# EAGLE design Kb_right (EAGLE 9.6.2)
COMPANY: ADAFRUIT INDUSTRIES; DRAWN: KTOWN; REV: B
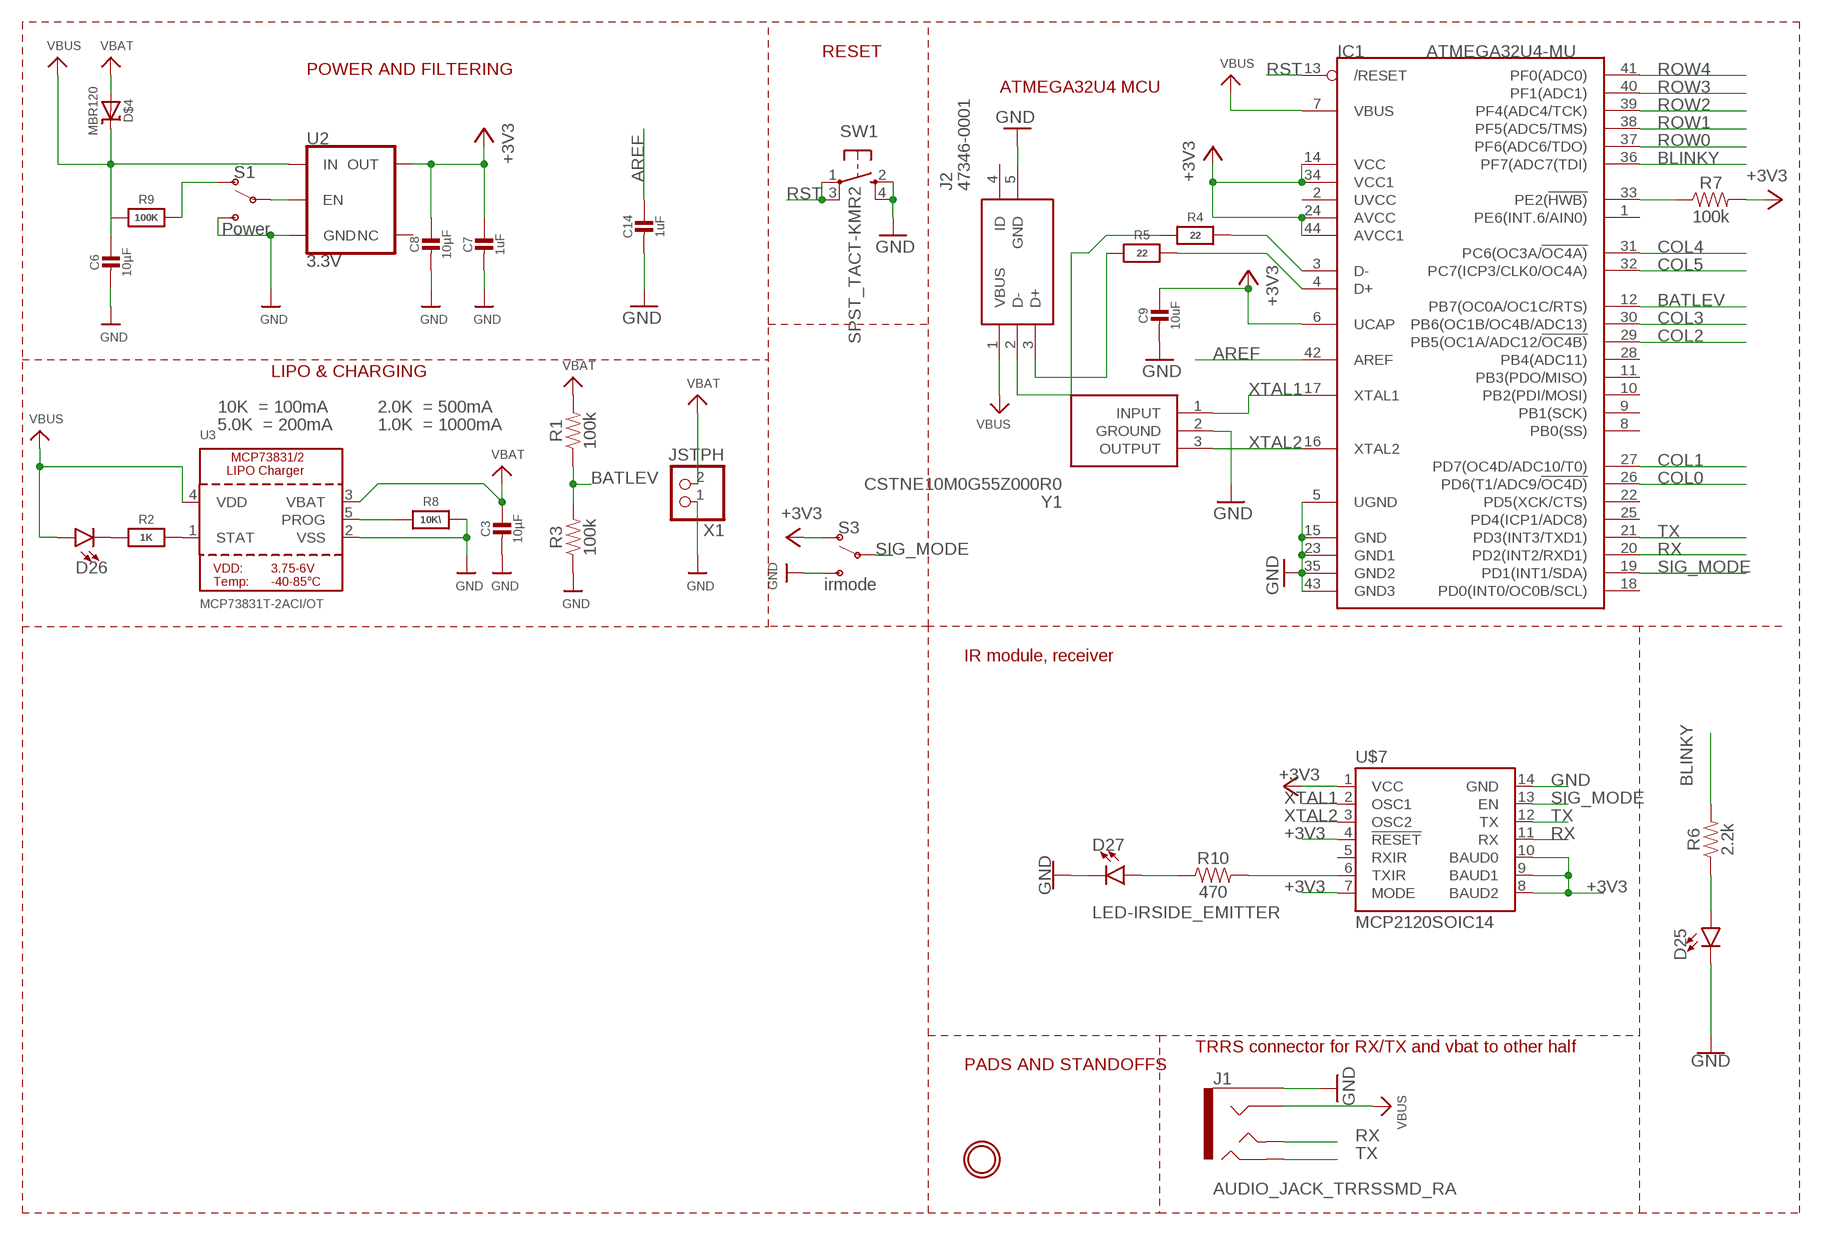
[diagram p0: schematic, sheet 1, part 1 of 2]
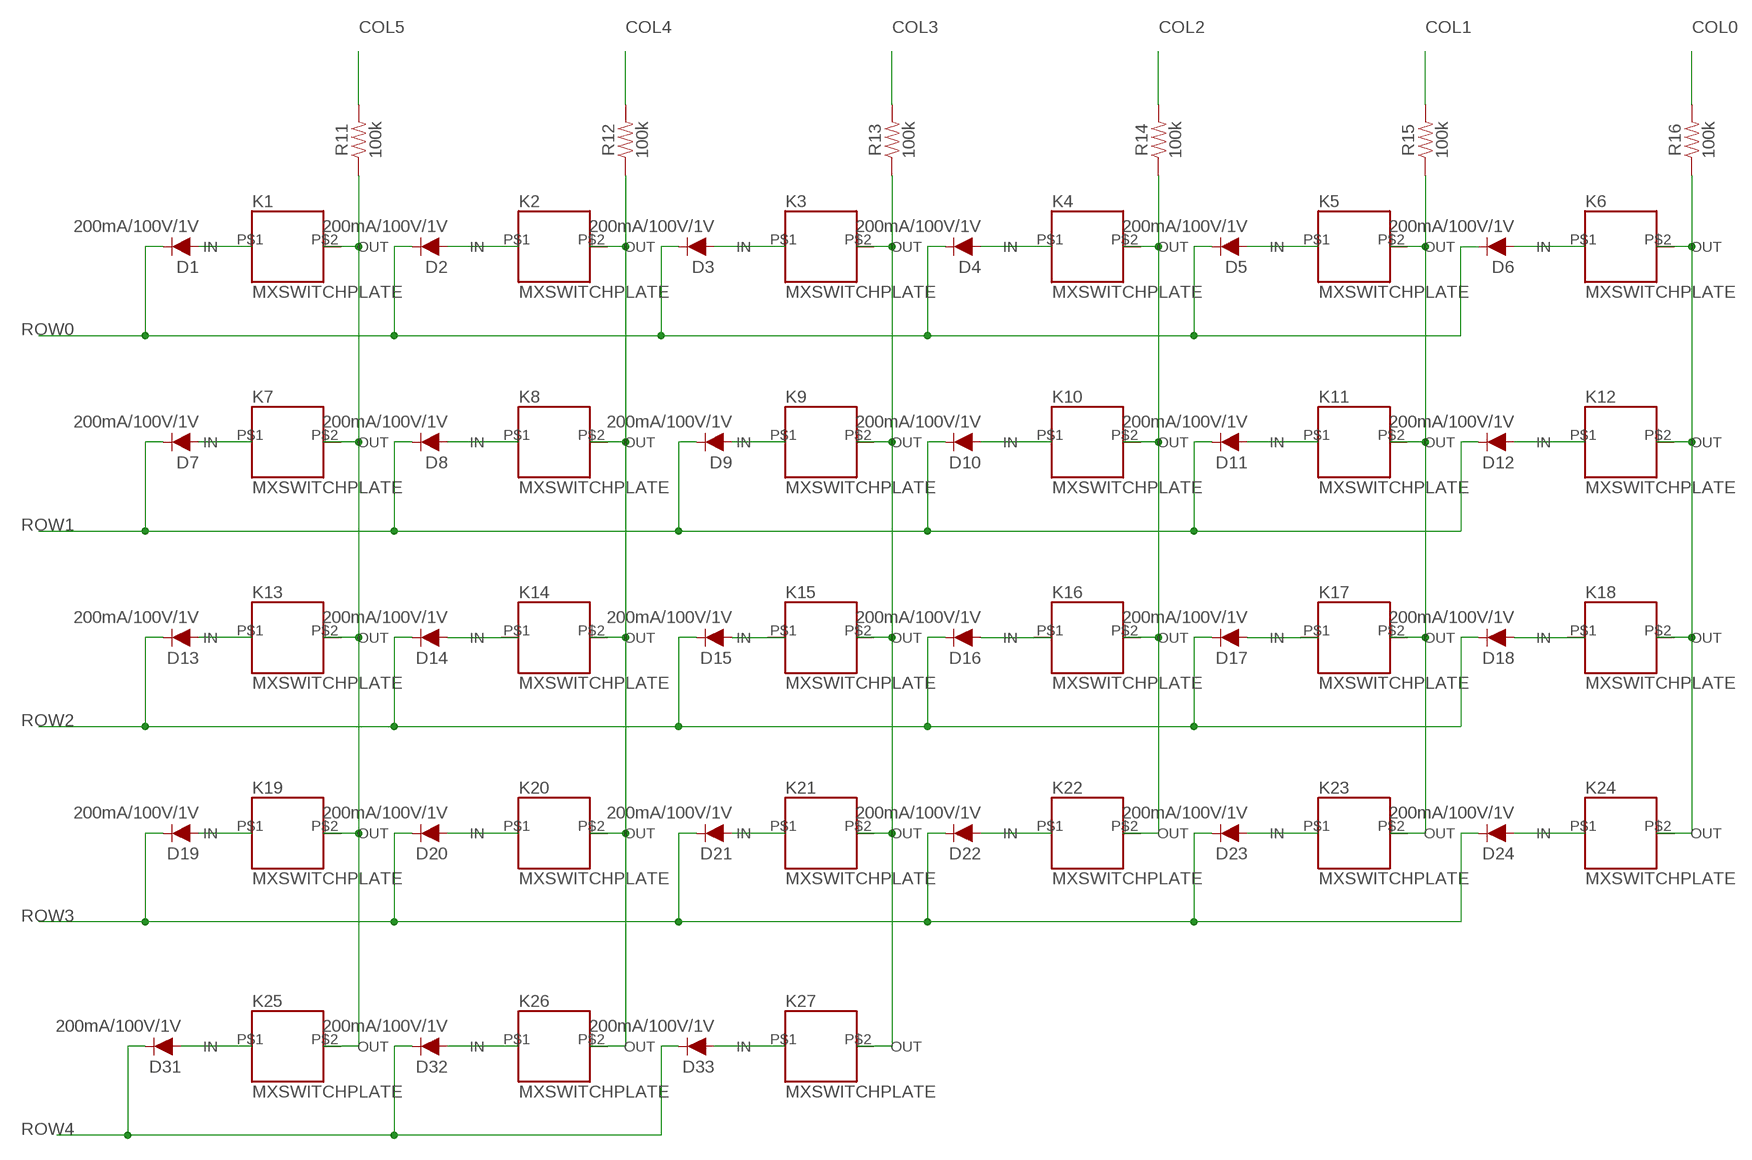
[diagram p1: schematic, sheet 1, part 2 of 2]

## Parts
C3  10µF  CAP_CERAMIC0805-NOOUTLINE  [0805-NO]
C6  10µF  CAP_CERAMIC0805-NOOUTLINE  [0805-NO]
C7  1uF  CAP_CERAMIC0603_NO  [0603-NO]
C8  10µF  CAP_CERAMIC0805-NOOUTLINE  [0805-NO]
C9  10uF  CAP_CERAMIC_0805MP  [_0805MP]
C14  1uF  CAP_CERAMIC0603_NO  [0603-NO]
D1  200mA/100V/1V  DIODE-1N4148  [DIODE-1N4148]
D2  200mA/100V/1V  DIODE-1N4148  [DIODE-1N4148]
D3  200mA/100V/1V  DIODE-1N4148  [DIODE-1N4148]
D4  200mA/100V/1V  DIODE-1N4148  [DIODE-1N4148]
D5  200mA/100V/1V  DIODE-1N4148  [DIODE-1N4148]
D6  200mA/100V/1V  DIODE-1N4148  [DIODE-1N4148]
D7  200mA/100V/1V  DIODE-1N4148  [DIODE-1N4148]
D8  200mA/100V/1V  DIODE-1N4148  [DIODE-1N4148]
D9  200mA/100V/1V  DIODE-1N4148  [DIODE-1N4148]
D10  200mA/100V/1V  DIODE-1N4148  [DIODE-1N4148]
D11  200mA/100V/1V  DIODE-1N4148  [DIODE-1N4148]
D12  200mA/100V/1V  DIODE-1N4148  [DIODE-1N4148]
D13  200mA/100V/1V  DIODE-1N4148  [DIODE-1N4148]
D14  200mA/100V/1V  DIODE-1N4148  [DIODE-1N4148]
D15  200mA/100V/1V  DIODE-1N4148  [DIODE-1N4148]
D16  200mA/100V/1V  DIODE-1N4148  [DIODE-1N4148]
D17  200mA/100V/1V  DIODE-1N4148  [DIODE-1N4148]
D18  200mA/100V/1V  DIODE-1N4148  [DIODE-1N4148]
D19  200mA/100V/1V  DIODE-1N4148  [DIODE-1N4148]
D20  200mA/100V/1V  DIODE-1N4148  [DIODE-1N4148]
D21  200mA/100V/1V  DIODE-1N4148  [DIODE-1N4148]
D22  200mA/100V/1V  DIODE-1N4148  [DIODE-1N4148]
D23  200mA/100V/1V  DIODE-1N4148  [DIODE-1N4148]
D24  200mA/100V/1V  DIODE-1N4148  [DIODE-1N4148]
D25  LED-3MM-NO_SILK  [LED_3MM-NS]
D26  LED-3MM-NO_SILK  [LED_3MM-NS]
D27  LED-IRSIDE_EMITTER  [LTE-302]
D31  200mA/100V/1V  DIODE-1N4148  [DIODE-1N4148]
D32  200mA/100V/1V  DIODE-1N4148  [DIODE-1N4148]
D33  200mA/100V/1V  DIODE-1N4148  [DIODE-1N4148]
D$4  MBR120  DIODE-SCHOTTKYSOD-123  [SOD-123]
IC1  ATMEGA32U4-MU  [TQFN44_7MM]
J1  AUDIO_JACK_TRRSSMD_RA  [AUDIO_JACK_3.5MM_TRRS_SMD_RA]
J2  47346-0001  [47346-0001]
K1  MXSWITCHPLATE  [MXSWITCHPLATE]
K2  MXSWITCHPLATE  [MXSWITCHPLATE]
K3  MXSWITCHPLATE  [MXSWITCHPLATE]
K4  MXSWITCHPLATE  [MXSWITCHPLATE]
K5  MXSWITCHPLATE  [MXSWITCHPLATE]
K6  MXSWITCHPLATE  [MXSWITCHPLATE]
K7  MXSWITCHPLATE  [MXSWITCHPLATE]
K8  MXSWITCHPLATE  [MXSWITCHPLATE]
K9  MXSWITCHPLATE  [MXSWITCHPLATE]
K10  MXSWITCHPLATE  [MXSWITCHPLATE]
K11  MXSWITCHPLATE  [MXSWITCHPLATE]
K12  MXSWITCHPLATE  [MXSWITCHPLATE]
K13  MXSWITCHPLATE  [MXSWITCHPLATE]
K14  MXSWITCHPLATE  [MXSWITCHPLATE]
K15  MXSWITCHPLATE  [MXSWITCHPLATE]
K16  MXSWITCHPLATE  [MXSWITCHPLATE]
K17  MXSWITCHPLATE  [MXSWITCHPLATE]
K18  MXSWITCHPLATE  [MXSWITCHPLATE]
K19  MXSWITCHPLATE  [MXSWITCHPLATE]
K20  MXSWITCHPLATE  [MXSWITCHPLATE]
K21  MXSWITCHPLATE  [MXSWITCHPLATE]
K22  MXSWITCHPLATE  [MXSWITCHPLATE]
K23  MXSWITCHPLATE  [MXSWITCHPLATE]
K24  MXSWITCHPLATE  [MXSWITCHPLATE]
K25  MXSWITCHPLATE  [MXSWITCHPLATE]
K26  MXSWITCHPLATE  [MXSWITCHPLATE]
K27  MXSWITCHPLATE  [MXSWITCHPLATE]
R1  100k  100KOHM-0603-1/10W-1%  [0603]
R2  1K  RESISTOR_0603_NOOUT  [0603-NO]
R3  100k  100KOHM-0603-1/10W-1%  [0603]
R4  22  RESISTOR_0603_NOOUT  [0603-NO]
R5  22  RESISTOR_0603_NOOUT  [0603-NO]
R6  2.2k  2.2KOHM-0603-1/10W-1%  [0603]
R7  100k  100KOHM-0603-1/10W-1%  [0603]
R8  10K\  RESISTOR_0603_NOOUT  [0603-NO]
R9  100K  RESISTOR_0603_NOOUT  [0603-NO]
R10  470  470OHM-0603-1/10W-1%  [0603]
R11  100k  100KOHM-0603-1/10W-1%  [0603]
R12  100k  100KOHM-0603-1/10W-1%  [0603]
R13  100k  100KOHM-0603-1/10W-1%  [0603]
R14  100k  100KOHM-0603-1/10W-1%  [0603]
R15  100k  100KOHM-0603-1/10W-1%  [0603]
R16  100k  100KOHM-0603-1/10W-1%  [0603]
S1  Power  SWITCH-SPDT-SMD-RIGHT-ANGLE  [SWITCH_SPST_SMD_A]
S3  irmode  SWITCH-SPDT-SMD-RIGHT-ANGLE  [SWITCH_SPST_SMD_A]
SW1  SPST_TACT-KMR2  [KMR2]
U2  3.3V  V_REG_AP2112K-3.3V  [SOT23-5]
U3  MCP73831T-2ACI/OT  MCP73831/2  [SOT23-5]
U$2  MOUNTINGHOLE2.5  [MOUNTINGHOLE_2.5_PLATED]
U$7  MCP2120SOIC14  [SOIC127P600X175-14N]
X1  JSTPH  CON_JST_PH_2PIN  [JSTPH2]
Y1  CSTNE10M0G55Z000R0  [CSTNE10M0G55Z000R0]

## Nets
+3V3: C7.1 C8.1 C9.1 IC1.6(UCAP) IC1.14(VCC) IC1.24(AVCC) IC1.34(VCC1) IC1.44(AVCC1) R7.2 S3.1(O) U2.5(OUT) U$7.1(VCC) U$7.4(!RESET) U$7.7(MODE) U$7.8(BAUD2) U$7.9(BAUD1) U$7.10(BAUD0)
AREF: C14.1 IC1.42(AREF)
BATLEV: IC1.12(PB7(OC0A/OC1C/RTS)) R1.1 R3.2
BLINKY: IC1.36(PF7(ADC7(TDI)) R6.2
COL0: IC1.26(PD6(T1/ADC9/!OC4D)) R16.2
COL1: IC1.27(PD7(OC4D/ADC10/T0)) R15.2
COL2: IC1.29(PB5(OC1A/ADC12/!OC4B)) R14.2
COL3: IC1.30(PB6(OC1B/OC4B/ADC13)) R13.2
COL4: IC1.31(PC6(OC3A/!OC4A)) R12.2
COL5: IC1.32(PC7(ICP3/CLK0/OC4A)) R11.2
D+: IC1.4(D+) R5.2
D-: IC1.3(D-) R4.2
GND: C3.2 C6.2 C7.2 C8.2 C9.2 C14.2 D25.K(C) D27.C IC1.5(UGND) IC1.15(GND) IC1.23(GND1) IC1.35(GND2) IC1.43(GND3) J1.EARTH J2.5(GND) R3.1 R8.2 S1.3(S) S3.3(S) SW1.2(S) SW1.4(S1) U2.2(GND) U3.2(VSS) U$7.14(GND) X1.1 Y1.2(GROUND)
N$1: D26.K(C) R2.1
N$2: D27.A R10.1
N$3: R2.2 U3.1(STAT)
N$4: R8.1 U3.5(PROG)
N$5: D25.A R6.1
N$6: IC1.33(PE2(!HWB)) R7.1
N$7: K1.P$2(OUT) K7.P$2(OUT) K13.P$2(OUT) K19.P$2(OUT) K25.P$2(OUT) R11.1
N$8: K2.P$2(OUT) K8.P$2(OUT) K14.P$2(OUT) K20.P$2(OUT) K26.P$2(OUT) R12.1
N$9: K3.P$2(OUT) K9.P$2(OUT) K15.P$2(OUT) K21.P$2(OUT) K27.P$2(OUT) R13.1
N$10: K4.P$2(OUT) K10.P$2(OUT) K16.P$2(OUT) K22.P$2(OUT) R14.1
N$11: R9.2 S1.1(O)
N$12: S1.2(P) U2.3(EN)
N$13: K5.P$2(OUT) K11.P$2(OUT) K17.P$2(OUT) K23.P$2(OUT) R15.1
N$14: K6.P$2(OUT) K12.P$2(OUT) K18.P$2(OUT) K24.P$2(OUT) R16.1
N$15: J2.3(D+) R5.1
N$16: J2.2(D-) R4.1
N$17: R10.2 U$7.6(TXIR)
N$23: D1.A K1.P$1(IN)
N$24: D2.A K2.P$1(IN)
N$25: D3.A K3.P$1(IN)
N$26: D4.A K4.P$1(IN)
N$27: D5.A K5.P$1(IN)
N$28: D6.A K6.P$1(IN)
N$29: D12.A K12.P$1(IN)
N$30: D11.A K11.P$1(IN)
N$31: D10.A K10.P$1(IN)
N$32: D9.A K9.P$1(IN)
N$33: D8.A K8.P$1(IN)
N$34: D7.A K7.P$1(IN)
N$35: D13.A K13.P$1(IN)
N$36: D14.A K14.P$1(IN)
N$37: D15.A K15.P$1(IN)
N$38: D16.A K16.P$1(IN)
N$39: D17.A K17.P$1(IN)
N$40: D18.A K18.P$1(IN)
N$41: D24.A K24.P$1(IN)
N$42: D23.A K23.P$1(IN)
N$43: D22.A K22.P$1(IN)
N$44: D21.A K21.P$1(IN)
N$45: D20.A K20.P$1(IN)
N$46: D19.A K19.P$1(IN)
N$53: D33.A K27.P$1(IN)
N$54: D32.A K26.P$1(IN)
N$55: D31.A K25.P$1(IN)
ROW0: D1.C D2.C D3.C D4.C D5.C D6.C IC1.37(PF6(ADC6/TDO))
ROW1: D7.C D8.C D9.C D10.C D11.C D12.C IC1.38(PF5(ADC5/TMS))
ROW2: D13.C D14.C D15.C D16.C D17.C D18.C IC1.39(PF4(ADC4/TCK))
ROW3: D19.C D20.C D21.C D22.C D23.C D24.C IC1.40(PF1(ADC1))
ROW4: D31.C D32.C D33.C IC1.41(PF0(ADC0))
RST: IC1.13(/RESET) SW1.1(P) SW1.3(P1)
RX: IC1.20(PD2(INT2/RXD1)) J1.TIP U$7.11(RX)
SIG_MODE: IC1.19(PD1(INT1/SDA)) S3.2(P) U$7.13(EN)
TX: IC1.21(PD3(INT3/TXD1)) J1.RING2 U$7.12(TX)
VBAT: C3.1 D$4.A R1.2 U3.3(VBAT) X1.2
VBUS: C6.1 D26.A D$4.C IC1.7(VBUS) J1.RING1 J2.1(VBUS) R9.1 U2.1(IN) U3.4(VDD)
XTAL1: IC1.17(XTAL1) U$7.2(OSC1) Y1.1(INPUT)
XTAL2: IC1.16(XTAL2) U$7.3(OSC2) Y1.3(OUTPUT)
Unconnected: IC1.1(PE6(INT.6/AIN0)) IC1.2(UVCC) IC1.8(PB0(SS)) IC1.9(PB1(SCK)) IC1.10(PB2(PDI/MOSI)) IC1.11(PB3(PDO/MISO)) IC1.18(PD0(INT0/OC0B/SCL)) IC1.22(PD5(XCK/CTS)) IC1.25(PD4(ICP1/ADC8)) IC1.28(PB4(ADC11)) J2.4(ID) U2.4(NC) U$7.5(RXIR)

## Notes on the sheet
- RESET
- POWER AND FILTERING
- ATMEGA32U4 MCU
- LIPO & CHARGING
- 10K  = 100mA | 2.0K  = 500mA
- 5.0K  = 200mA | 1.0K  = 1000mA
- IR module, receiver
- TRRS connector for RX/TX and vbat to other half
- PADS AND STANDOFFS

## Library data of the parts
C3 C6-C9 C14 = microbuilder:CAP_CERAMIC: Ceramic Capacitors For new designs, use the packages preceded by an '_' character since they are more reliable: The following footprints should be used on most boards: _0402 - Standard footprint for regular board layouts _0603 - Standard footprint for regular board layouts _0805 - Standard footprint for regular board layouts _1206 - Standard footprint for regular board layouts For extremely tight-pitch boards where space is at a premium, the following 'micro-pitch' footprints can be used (smaller pads, no silkscreen outline, etc.): _0402MP - Micro-pitch footprint for very dense/compact boards _0603MP - Micro-pitch footprint for very dense/compact boards _0805MP - Micro-pitch footprint for very dense/compact boards _1206MP - Micro-pitch footprint for very dense/compact boards
D1-D24 D31-D33 = SparkFun-DiscreteSemi:DIODE: Diode These are standard reverse protection diodes and small signal diodes. SparkFun Products: SparkFun SparkPunk Sound Kit <https://www.sparkfun.com/products/11177> SparkFun ESP8266 Thing <https://www.sparkfun.com/products/13231>; PROD_ID: DIO-08378
D25 D26 = SparkFun-LED:LED: LED (Generic) Standard schematic elements and footprints for 5mm, 3mm, 1206, and 0603 sized LEDs. Generic LEDs with no color specified.
D27 = SparkFun-LED:LED-IR: Infrared LED (IR) Wavelength: 940nm Packages: TSAL6100 LTE302 - Side firing. Check SparkFun-Sensors.lbr for the receiver SparkFun Products: ZX Distance and Gesture Sensor <[https://www.sparkfun.com/products/12780]> Infrared Emitters and Detectors <https://www.sparkfun.com/products/241>; PROD_ID: DIO-10904; SF_ID: SEN-00241
D$4 = microbuilder:DIODE-SCHOTTKY
IC1 = microbuilder:ATMEGA32U4: http://www.ladyada.net/library/eagle
J1 = SparkFun-Connectors:AUDIO_JACK_TRRS: Audio Jack - 3.5mm TRRS (SMD) This is a 3.5mm TRRS SMD audio jack. TRRS connectors are the audio-style connectors that you see on some phones, MP3 players and development boards. TRRS stands for “tip, ring, ring, sleeve,” which reflects that this has three conductors and a ground. SparkFun Products: Audio Jack <https://www.sparkfun.com/products/12639> mbed Starter Kit <https://www.sparkfun.com/products/12968> SparkFun TRRS 3.5mm Jack Breakout <https://www.sparkfun.com/products/11570>; PROD_ID: CONN-10676; SF_ID: PRT-12639
J2 = SamacSys_Parts:47346-0001: Micro USB B Receptacle Bottom Mount Assy Molex Right Angle SMT Type B Version 2.0 Micro USB Connector Socket, 30 V ac, 1A 47352 MICRO-USB Source: Datasheet <http://www.molex.com/pdm_docs/sd/473460001_sd.pdf>; DESCRIPTION: Micro USB B Receptacle Bottom Mount Assy Molex Right Angle SMT Type B Version 2.0 Micro USB Connector Socket, 30 V ac, 1A 47352 MICRO-USB; HEIGHT: mm; MANUFACTURER_NAME: Molex; MANUFACTURER_PART_NUMBER: 47346-0001; MOUSER_PART_NUMBER: 538-47346-0001; MOUSER_PRICE-STOCK: https://www.mouser.co.uk/ProductDetail/Molex/47346-0001?qs=c2CV6XM0DweJBWaSeyWeCw%3D%3D
K1-K27 = Kb parts:MXSWITCHPLATE
R1 R3 R7 R11-R16 = SparkFun-Resistors:100KOHM: 100kΩ resistor A resistor is a passive two-terminal electrical component that implements electrical resistance as a circuit element. Resistors act to reduce current flow, and, at the same time, act to lower voltage levels within circuits. - Wikipedia; PROD_ID: RES-07828
R2 R4 R5 R8 R9 = microbuilder:RESISTOR: Resistors For new designs, use the packages preceded by an '_' character since they are more reliable: The following footprints should be used on most boards: _0402 - Standard footprint for regular board layouts _0603 - Standard footprint for regular board layouts _0805 - Standard footprint for regular board layouts _1206 - Standard footprint for regular board layouts For extremely tight-pitch boards where space is at a premium, the following 'micro-pitch' footprints can be used (smaller pads, no silkscreen outline, etc.): _0402MP - Micro-pitch footprint for very dense/compact boards _0603MP - Micro-pitch footprint for very dense/compact boards _0805MP - Micro-pitch footprint for very dense/compact boards _1206MP - Micro-pitch footprint for very dense/compact boards
R6 = SparkFun-Resistors:2.2KOHM: 2.2kΩ resistor A resistor is a passive two-terminal electrical component that implements electrical resistance as a circuit element. Resistors act to reduce current flow, and, at the same time, act to lower voltage levels within circuits. - Wikipedia; PROD_ID: RES-08272
R10 = SparkFun-Resistors:470OHM: 470Ω resistor A resistor is a passive two-terminal electrical component that implements electrical resistance as a circuit element. Resistors act to reduce current flow, and, at the same time, act to lower voltage levels within circuits. - Wikipedia; PROD_ID: RES-07869
S1 S3 = SparkFun-Switches:SWITCH-SPDT: Single Pole, Double Throw (SPDT) Switch Single-pole, double-throw (SPDT) switch. Variant Overview SMD-AYZ0202 Surface Mount DPDT Switch <https://www.sparkfun.com/products/597> (COM-00597) Used on e.g. LilyPad Arduino USB - ATmega32U4 Board <https://www.sparkfun.com/products/12049> PTH-11.6X4.0MM SPDT Mini Power Switch <https://www.sparkfun.com/products/102> (COM-00102) Used on e.g. SparkFun Simon Says - Through-Hole Soldering Kit <https://www.sparkfun.com/products/10547> (KIT-10547) PTH-11.6X4.0MM-KIT KIT version of SPDT Mini Power Switch - Simplifies soldering by removing tStop of switch pins - only one side can be soldered. PTH-11.6X4.0MM-LOCK LOCK version of SPDT Mini Power Switch - Offset pins hold switch in place for easier soldering. SMD-RIGHT-ANGLE Surface Mount Right Angle Switch <https://www.sparkfun.com/products/10860> (COM-10860) Used on e.g. SparkFun ESP8266 Thing <https://www.sparkfun.com/products/13231>; PROD_ID: SWCH-10651; SF_SKU: COM-10860
SW1 = adafruit:SPST_TACT: SMT 6mm switch, EVQQ2 series http://www.ladyada.net/library/eagle
U2 = SparkFun-IC-Power:V_REG_AP2112: AP2112 - 600mA CMOS LDO Regulator w/ Enable The AP2112 is CMOS process low dropout linear regulator with enable function, the regulator delivers a guaranteed 600mA (min.) continuous load current. Features Output Voltage Accuracy: ±1.5% Output Current: 600mA (Min.) Foldback Short Current Protection: 50mA Enable Function to Turn ON/OFF VOUT Low Dropout Voltage (3.3V): 250mV (Typ.) @IOUT=600mA Excellent Load Regulation: 0.2%/A (Typ.) Excellent Line Regulation: 0.02%/V (Typ.) Low Quiescent Current: 55μA (Typ.) Low Standby Current: 0.01μA (Typ.) Low Output Noise: 50μVRMS PSRR: 100Hz -65dB, 1kHz -65dB OTSD Protection Stable with 1.0μF Flexible Cap: Ceramic, Tantalum and Aluminum Electrolytic Operation Temperature Range: -40°C to 85°C ESD: MM 400V, HBM 4000V; PROD_ID: VREG-12457
U3 = microbuilder:MCP73831/2: MCP73831/2 LIPO Charger VDD: 3.75 - 6V Temp -40 - 85°C Programmable Charge Rate: 15-500mA NOTE: STAT is a tri-state logic output on the MCP73831 and an open-drain output on the MCP73832. SOT23-5 with 4.2V output and tri-state logic on STAT = MCP73831T-2ACI/OT
U$2 = microbuilder:MOUNTINGHOLE: Mounting Hole For #2 screws (0.086"/2.18mm width, 0.094"/2.4mm hole) use 2.5mm; BOM: EXCLUDE
U$7 = Kb parts:MCP2120
X1 = microbuilder:CON_JST_PH_2PIN: JST 2-Pin Right-Angle Connector PH-Series - 4UConnector: 17311 SH-Series - 4UConnector: 07278
Y1 = SamacSys_Parts:CSTNE10M0G55Z000R0: Piezoelectric Ceramic Resonator 10.0000MHZ 33PF SMD Wide temperature range Source: Datasheet <https://componentsearchengine.com/Datasheets/1/CSTNE10M0G55Z000R0.pdf>; DESCRIPTION: Piezoelectric Ceramic Resonator 10.0000MHZ 33PF SMD Wide temperature range; HEIGHT: 0.8mm; MANUFACTURER_NAME: Murata Electronics; MANUFACTURER_PART_NUMBER: CSTNE10M0G55Z000R0; MOUSER_PART_NUMBER: 81-CSTNE10M0G55Z000R; MOUSER_PRICE-STOCK: https://www.mouser.com/Search/Refine.aspx?Keyword=81-CSTNE10M0G55Z000R

## Board
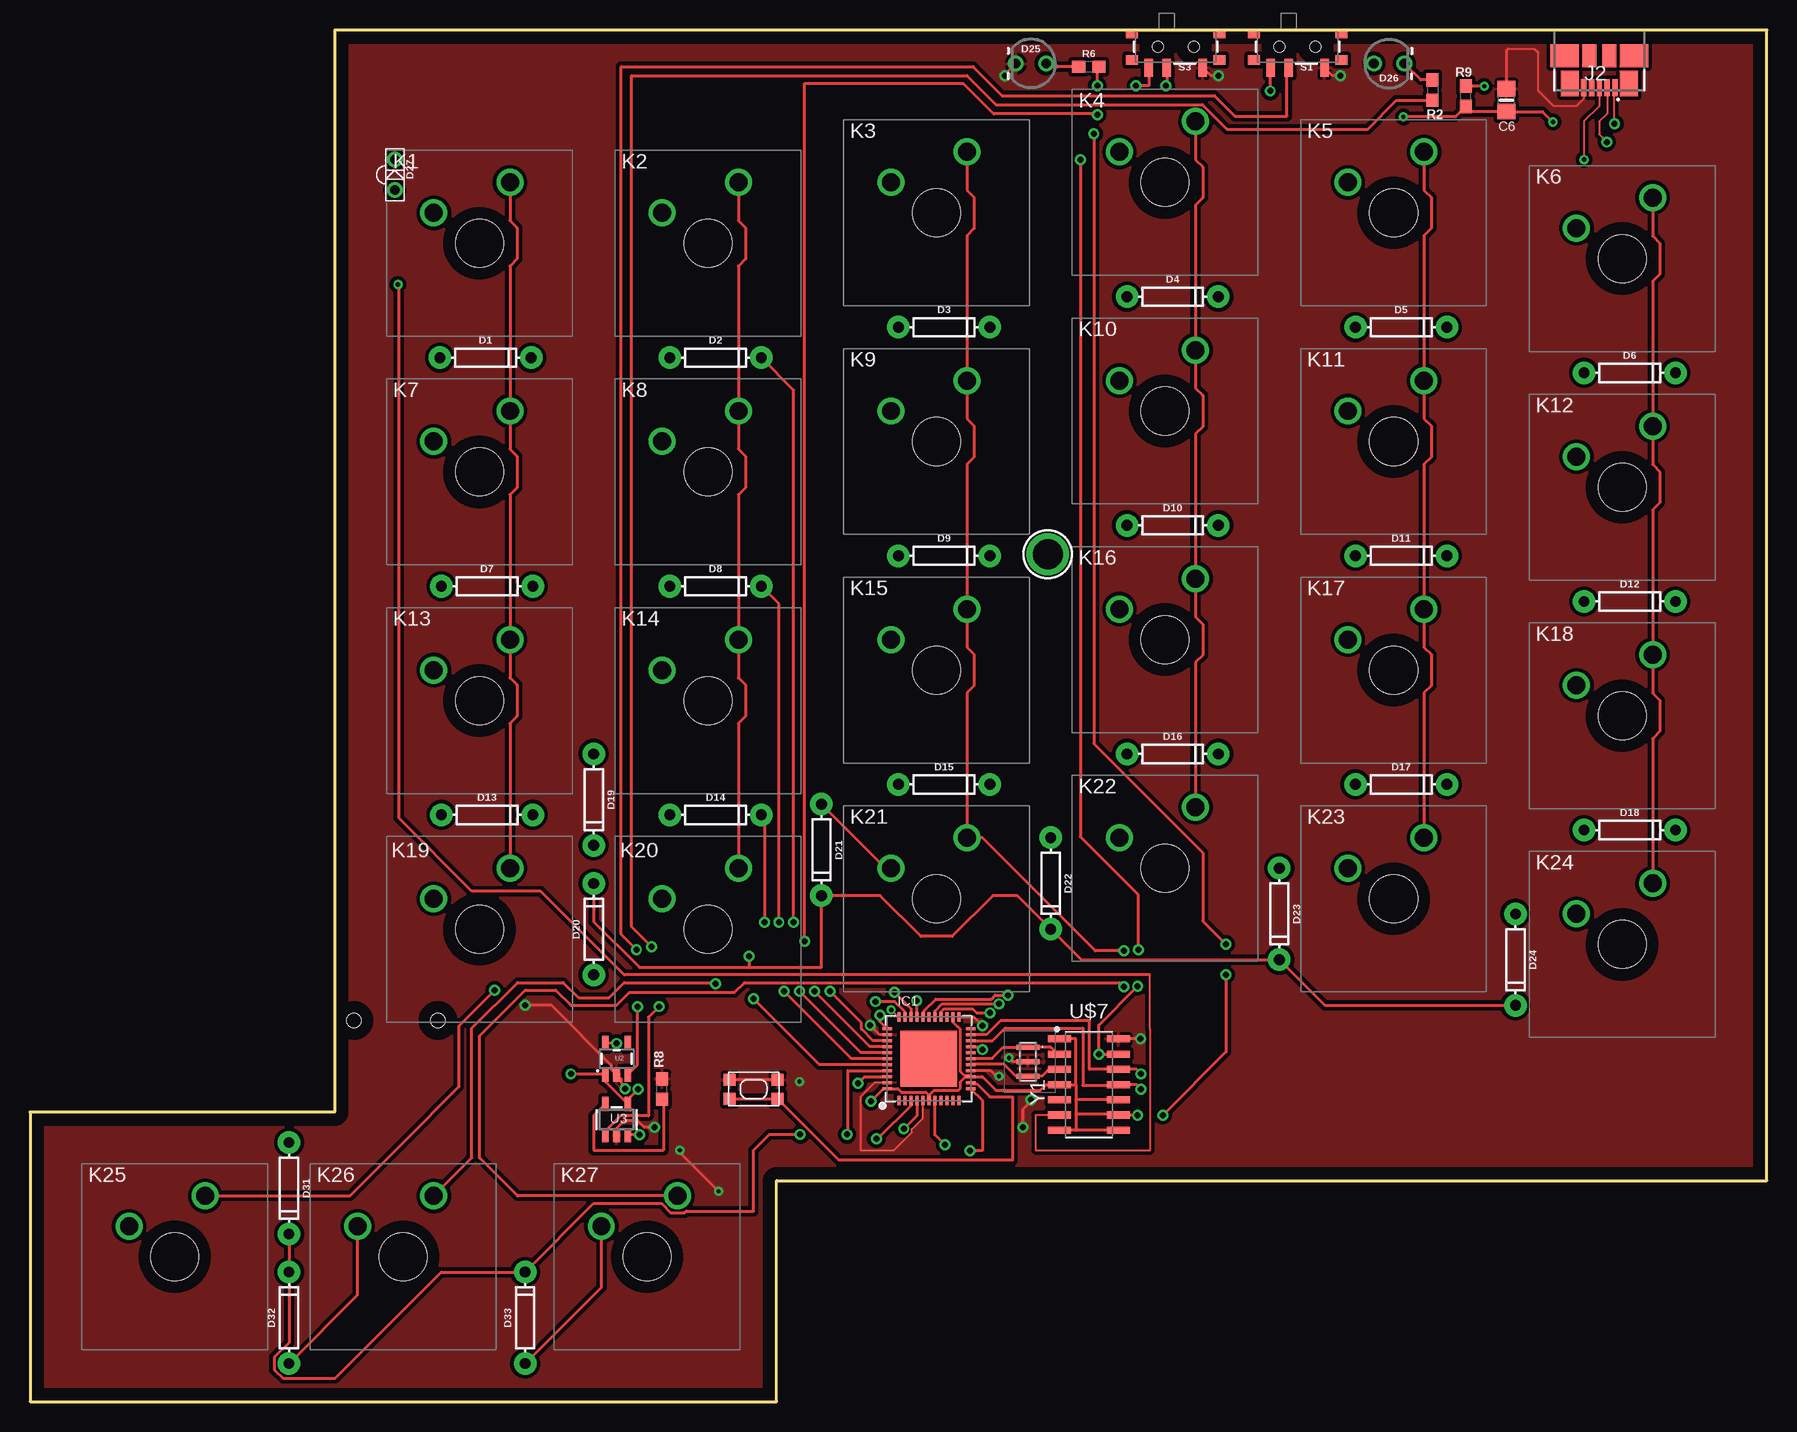
[diagram p2: board, top side]
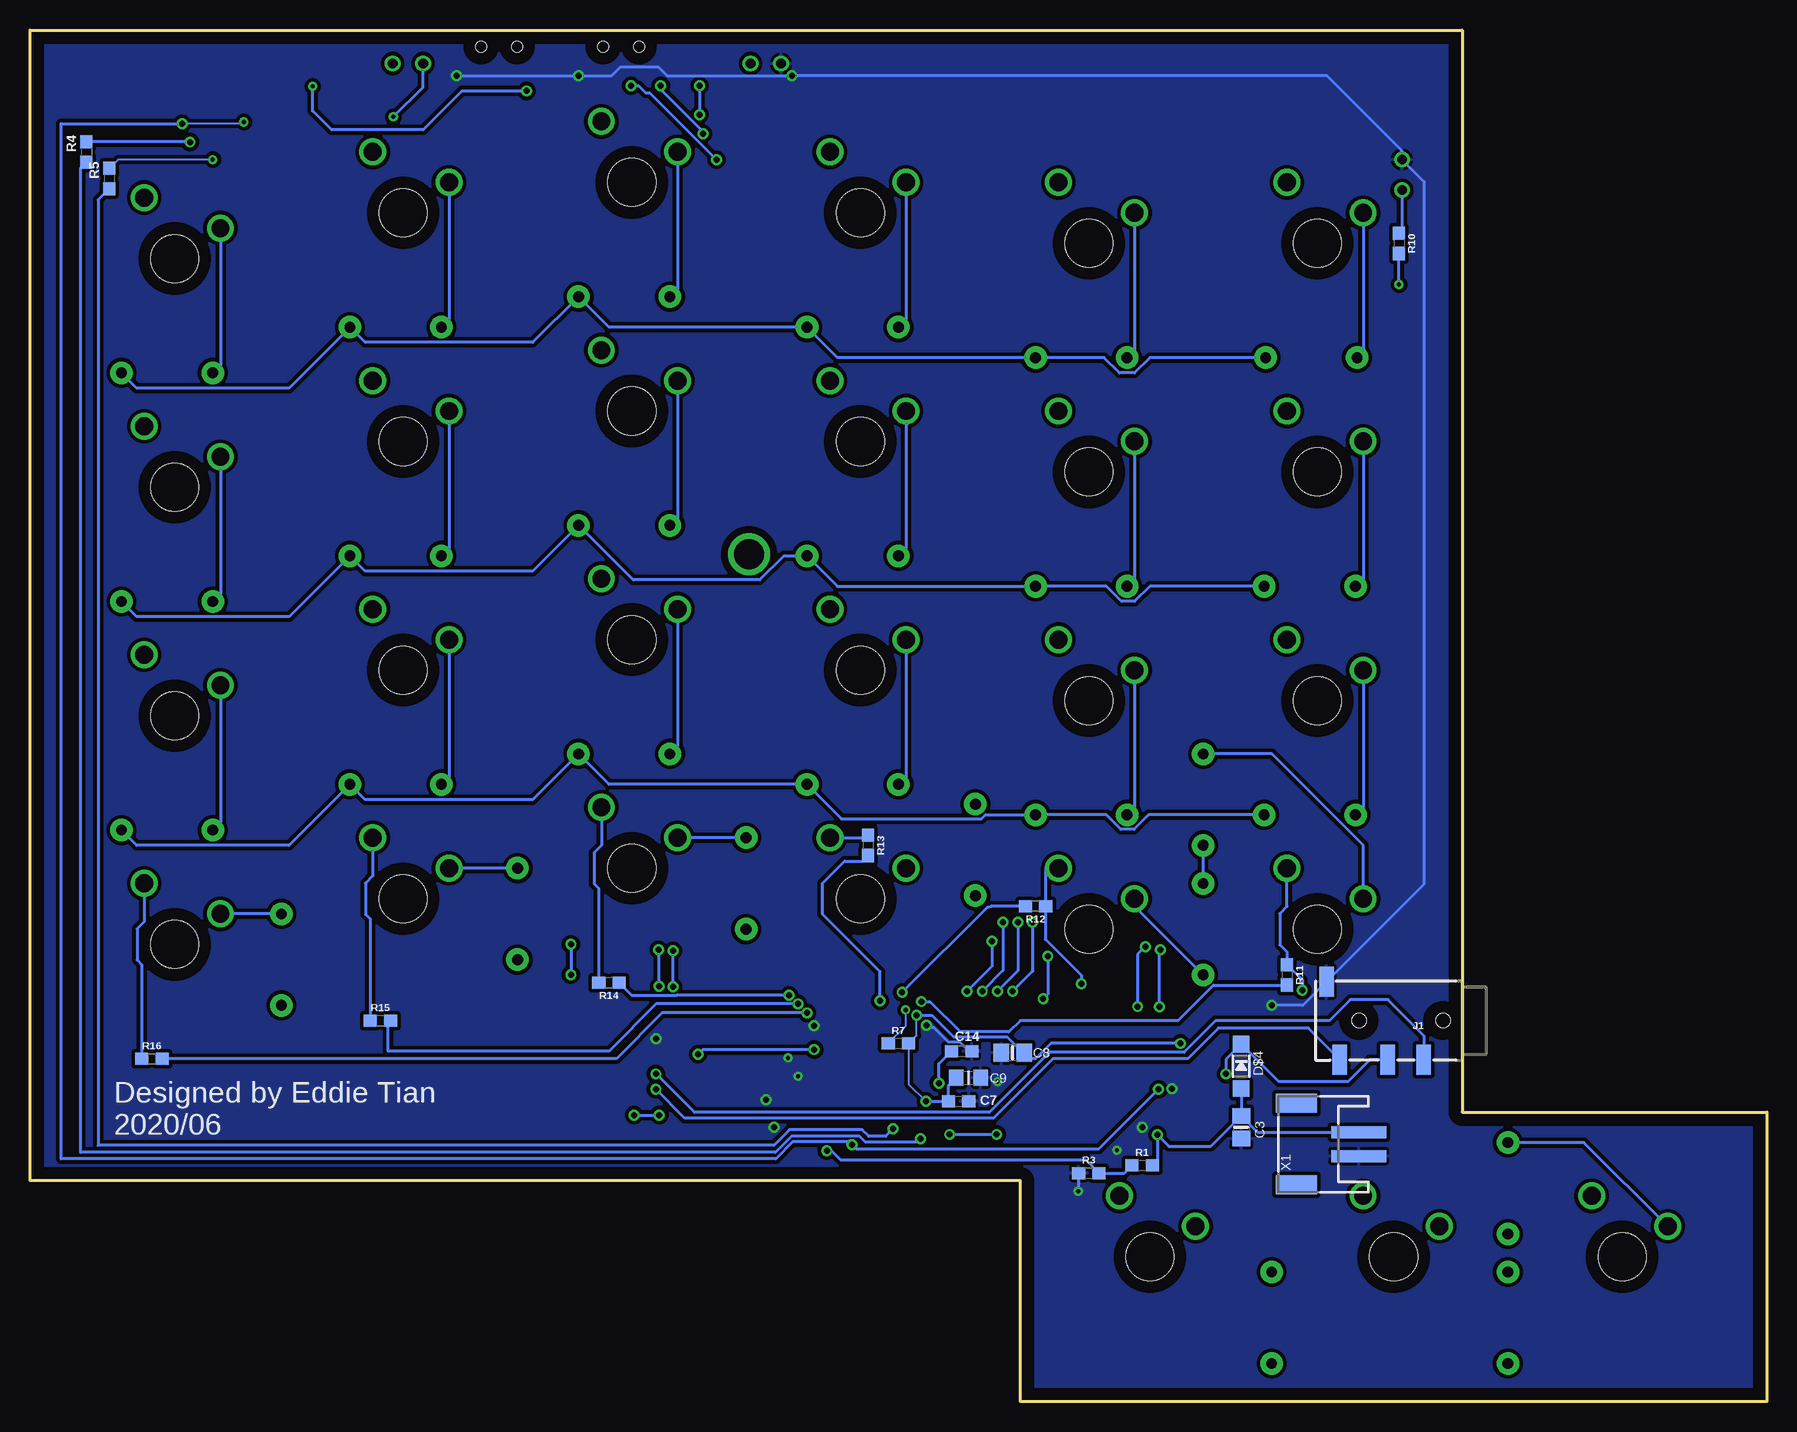
[diagram p3: board, bottom side, seen from below]

Size 144.78 x 114.3 mm. Coordinates in mm from the lower left corner, seen from the top.
Outline: 25.4,114.3 25.4,24.13 0,24.13 0,0 62.23,0 62.23,18.41 144.78,18.41 144.78,114.3 25.4,114.3
Copper layers (1*16): Top 0.035mm / dielectric 1.5mm / Bottom 0.035mm
Design rules "default": minimum track width 6mil, minimum drill 0.35mm, track to track 6mil, track to pad 6mil, pad to pad 6mil, via to via 6mil, smd to smd 6mil, copper to edge 40mil, drill to drill 6mil, minimum pad ring 10mil, minimum via ring 8mil, stop-mask expansion 4mil, vias tented up to drill 0mil, thermal gap 10mil

### Footprints (pad centres in the part's own frame; a part is rotated, then mirrored left to right if it is on the bottom)
0805-NO = smd 1.3 x 1.5: 1 -0.95,0; 2 0.95,0
0603-NO = smd 1.1 x 1: 1 -0.85,0; 2 0.85,0
_0805MP = smd 1.2 x 1.3: 1 -1.016,0; 2 1.016,0
DIODE-1N4148 = drill 0.9 pad 1.88: A -3.81,0; C 3.81,0
LED_3MM-NS = drill 0.813: A -1.27,0; K 1.27,0
LTE-302 = drill 0.8: A 1.27,0; C -1.27,0
SOD-123 = smd 1.4 x 1.4: A 1.85,0; C -1.85,0
TQFN44_7MM = smd 0.25 x 0.8: 1 -2.5,-3.475; 2 -2,-3.475; 3 -1.5,-3.475; 4 -1,-3.475; 5 -0.5,-3.475; 6 0,-3.475; 7 0.5,-3.475; 8 1,-3.475; 9 1.5,-3.475; 10 2,-3.475; 11 2.5,-3.475; 23 2.5,3.475; 24 2,3.475; 25 1.5,3.475; 26 1,3.475; 27 0.5,3.475; 28 0,3.475; 29 -0.5,3.475; 30 -1,3.475; 31 -1.5,3.475; 32 -2,3.475; 33 -2.5,3.475 | smd 0.8 x 0.25: 12 3.475,-2.5; 13 3.475,-2; 14 3.475,-1.5; 15 3.475,-1; 16 3.475,-0.5; 17 3.475,0; 18 3.475,0.5; 19 3.475,1; 20 3.475,1.5; 21 3.475,2; 22 3.475,2.5; 34 -3.475,2.5; 35 -3.475,2; 36 -3.475,1.5; 37 -3.475,1; 38 -3.475,0.5; 39 -3.475,0; 40 -3.475,-0.5; 41 -3.475,-1; 42 -3.475,-1.5; 43 -3.475,-2; 44 -3.475,-2.5 | smd 4.7 x 4.7: THERMAL 0,0
AUDIO_JACK_3.5MM_TRRS_SMD_RA = smd 1.2 x 2.5: EARTH 11.3,-3.25; RING1 6.2,3.25; RING2 3.2,3.25; TIP 10.2,3.25 | hole 1.2: 1.6,0; 8.6,0
47346-0001 = smd 0.45 x 1.38: 1 1.3,-4.81; 2 0.65,-4.81; 3 0,-4.81; 4 -0.65,-4.81; 5 -1.3,-4.81 | smd 1.475 x 2.1: 6 -2.453,-4.45; 7 2.453,-4.45 | smd 1.175 x 1.9: 8 0.838,-2.15; 9 -0.838,-2.15 | smd 2.375 x 1.9: 10 2.913,-2.15; 11 -2.913,-2.15
MXSWITCHPLATE = drill 1.499: P$1 -3.81,2.54; P$2 2.54,5.08 | hole 3.988: 0,0
0603 = smd 1.1 x 1: 1 -0.85,0; 2 0.85,0
SWITCH_SPST_SMD_A = smd 0.7 x 1.5: 1 -2.25,-1.75; 2 -0.75,-1.75; 3 2.25,-1.75 | smd 1 x 0.6: GND1 -3.65,1; GND3 3.65,1 | smd 1 x 0.8: GND2 -3.65,-1.1; GND4 3.65,-1.1 | hole 0.9: -1.5,0; 1.5,0
KMR2 = smd 1 x 1: 1 2,0.8; 2 2,-0.8; 3 -2,0.8; 4 -2,-0.8
SOT23-5 = smd 0.55 x 1.2: 1 -0.95,-1.3; 2 0,-1.3; 3 0.95,-1.3; 4 0.95,1.3; 5 -0.95,1.3
MOUNTINGHOLE_2.5_PLATED = drill 2.5 pad 3.2: P$1 0,0
SOIC127P600X175-14N = smd 1.901 x 0.599: 1 -2.455,3.81; 2 -2.455,2.54; 3 -2.455,1.27; 4 -2.455,0; 5 -2.455,-1.27; 6 -2.455,-2.54; 7 -2.455,-3.81; 8 2.455,-3.81; 9 2.455,-2.54; 10 2.455,-1.27; 11 2.455,0; 12 2.455,1.27; 13 2.455,2.54; 14 2.455,3.81
JSTPH2 = smd 1 x 4.6: 1 -1,-3.7; 2 1,-3.7 | smd 1.6 x 3.4: NC1 -3.4,1.5; NC2 3.4,1.5
CSTNE10M0G55Z000R0 = smd 0.4 x 1.9: 1 1.2,0; 2 0,0; 3 -1.2,0

### Placement (x,y rotation side)
C3  43.81,22.86 270 bottom
C6  123.06,108.46 90 top
C7  67.37,25.02 0 bottom
C8  62.86,29.08 180 bottom
C9  66.55,26.99 0 bottom
C14  67.12,29.21 0 bottom
D1  37.97,87 0 top
D2  57.15,87 0 top
D3  76.2,89.53 0 top
D4  95.25,92.08 0 top
D5  114.3,89.53 0 top
D6  133.35,85.73 0 top
D7  38.1,67.94 0 top
D8  57.15,67.94 0 top
D9  76.2,70.48 0 top
D10  95.25,73.03 0 top
D11  114.3,70.48 0 top
D12  133.35,66.67 0 top
D13  38.1,48.89 0 top
D14  57.15,48.89 0 top
D15  76.2,51.44 0 top
D16  95.25,53.97 0 top
D17  114.3,51.44 0 top
D18  133.35,47.62 0 top
D19  46.99,50.16 270 top
D20  46.99,39.37 90 top
D21  65.98,45.97 270 top
D22  85.09,43.18 270 top
D23  104.14,40.64 270 top
D24  123.83,36.83 270 top
D25  83.44,111.51 180 top
D26  113.28,111.51 0 top
D27  30.42,102.23 270 top
D31  21.59,17.78 270 top
D32  21.59,6.98 90 top
D33  41.28,6.98 90 top
D$4  43.81,27.94 270 bottom
IC1  74.93,28.57 0 top
J1  25.4,31.75 180 bottom
J2  130.81,114.3 0 top
K1  37.47,96.52 0 top
K2  56.52,96.52 0 top
K3  75.56,99.06 0 top
K4  94.62,101.6 0 top
K5  113.67,99.06 0 top
K6  132.72,95.25 0 top
K7  37.47,77.47 0 top
K8  56.52,77.47 0 top
K9  75.56,80.01 0 top
K10  94.62,82.55 0 top
K11  113.67,80.01 0 top
K12  132.72,76.2 0 top
K13  37.47,58.42 0 top
K14  56.52,58.42 0 top
K15  75.56,60.96 0 top
K16  94.62,63.5 0 top
K17  113.67,60.96 0 top
K18  132.72,57.15 0 top
K19  37.47,39.37 0 top
K20  56.52,39.37 0 top
K21  75.56,41.91 0 top
K22  94.62,44.45 0 top
K23  113.67,41.91 0 top
K24  132.72,38.1 0 top
K25  12.06,12.06 0 top
K26  31.11,12.06 0 top
K27  51.44,12.06 0 top
R1  52.07,19.68 0 bottom
R2  116.9,109.28 270 top
R3  56.52,19.05 0 bottom
R4  140.08,104.14 270 bottom
R5  138.18,101.92 270 bottom
R6  88.27,111.25 0 top
R7  72.39,29.84 0 bottom
R8  52.7,26.03 90 top
R9  119.7,108.78 90 top
R10  30.67,96.52 270 bottom
R11  40,35.56 270 bottom
R12  60.96,41.27 180 bottom
R13  74.93,46.36 270 bottom
R14  96.52,34.92 0 bottom
R15  115.57,31.75 0 bottom
R16  134.62,28.57 0 bottom
S1  105.66,112.9 0 top
S3  95.5,112.9 0 top
SW1  60.33,26.03 180 top
U2  48.89,28.57 0 top
U3  48.89,23.49 0 top
U$2  84.84,70.61 0 top
U$7  88.27,26.42 0 top
X1  37.72,21.46 90 bottom
Y1  83.19,28.32 90 top

### Tracks (layer width: path | path; a pad name or v marks a point on that pad's centre or on a via)
+3V3  (via drill 0.5)
  Top 0.254: IC1.14 79.39,27.07 80.52,25.94 84.22,25.94 84.7,26.42 U$7.4 87.19,26.42 | 87.19,22.61 U$7.7 | 87.19,26.42 87.19,25.15 | 87.19,25.15 87.19,23.94 | 87.19,23.94 87.19,22.61 | U$7.8 87.19,22.61 | 87.19,26.42 87.19,30.23 U$7.1 | U$7.10 87.19,25.15 | 87.19,23.94 90.66,23.94 U$7.9 v92.33,23.88 | v70.1,25.02 71.16,26.07 IC1.44 72.34,26.07 72.63,25.78 74.67,25.78 74.84,25.61 74.84,25.19 IC1.6 75.02,25.19 75.02,25.61 75.36,25.95 77.4,25.95 77.56,26.11 77.56,26.65 77.98,27.07 IC1.14 | IC1.14 78.31,27.17 77.89,27.17 77.56,27.5 77.56,31.04 77.4,31.2 77.36,31.2 76.93,31.63 IC1.24 | v48.89,29.84 47.97,29.84 U2.5 | IC1.34 70.87,31.66 v70.87,32.19 | S3.1 93.25,109.67 v92.2,109.67 | v99.69,38.1 97.75,40.04 97.75,45.75 88.67,54.83 v88.67,105.64 | v99.69,35.56 99.69,29.15 v94.43,23.88
  Bottom 0.152: v70.87,32.19 70.87,30.52 R7.2 71.54,26.45 v70.1,25.02
  Bottom 0.254: C9.1 68.22,26.33 C7.1 v70.1,25.02 | v48.89,29.84 59.69,29.84 60.96,28.57 61.41,28.57 C8.1 62.02,29.08 63.33,30.4 67.8,30.4 69.6,32.19 v70.87,32.19 | v92.2,109.67 92.2,109.35 88.67,105.81 v88.67,105.64 | v99.69,38.1 v99.69,35.56 | v94.43,23.88 v92.33,23.88
AREF  (via drill 0.5)
  Top 0.254: v69.03,26.54 69.53,27.04 71.42,27.04 IC1.42
  Bottom 0.254: v69.03,26.54 69.03,28.16 C14.1
BATLEV  (via drill 0.5)
  Top 0.254: IC1.12 79.38,25.1 79.38,20.91 v78.36,20.91
  Bottom 0.254: R1.1 53.56,19.05 R3.2 56.77,20.15 77.22,20.15 77.98,20.91 v78.36,20.91
BLINKY  (via drill 0.5)
  Top 0.254: v66.67,34.19 69.3,31.56 69.3,31.06 70.29,30.07 IC1.36 | v88.96,107.25 88.9,107.31 80.33,107.31 77.79,109.86 64.58,109.86 v64.58,38.35 | v88.96,109.67 88.96,111.1 R6.2
  Bottom 0.254: v88.96,109.67 v88.96,107.25 | v64.58,38.35 64.58,36.29 v66.67,34.19
COL0  (via drill 0.5)
  Top 0.254: v80.01,32.38 78.91,32.38 78.56,32.73 76.2,32.73 76.19,32.73 75.93,32.47 IC1.26
  Bottom 0.254: v80.01,32.38 92.08,32.38 95.88,28.57 R16.2
COL1  (via drill 0.5)
  Top 0.254: IC1.27 75.43,32.55 76.02,33.14 v80.76,33.14 v80.76,33.13
  Bottom 0.254: v80.76,33.13 92.6,33.13 96.52,29.21 114.94,29.21 114.94,31.53 R15.2
COL2  (via drill 0.5)
  Top 0.254: IC1.29 74.53,32.15 74.53,32.57 75.5,33.54 80.13,33.54 80.45,33.87 v81.51,33.87 v81.52,33.88
  Bottom 0.254: v81.52,33.88 90.85,33.88 90.88,33.84 94.59,33.84 R14.2
COL3  (via drill 0.5)
  Top 0.254: IC1.30 73.93,33.38 v73.91,33.4
  Bottom 0.254: v73.91,33.4 73.91,35.82 78.7,40.61 78.7,43.21 76.86,45.05 75.39,45.05 R13.2
COL4  (via drill 0.5)
  Top 0.254: v72.07,34.1 73.43,32.74 IC1.31
  Bottom 0.254: R12.2 64.66,41.27 64.97,41.21 v72.07,34.1
COL5  (via drill 0.5)
  Top 0.254: IC1.32 72.93,32.48 72.07,33.34 v70.48,33.34
  Bottom 0.254: R11.2 46.12,34.71 49.08,31.74 62.23,31.74 63.18,30.8 67.23,30.8 69.77,33.34 v70.48,33.34
D+  (via drill 0.5)
  Top 0.254: IC1.4 73.93,23.83 v72.84,22.73
  Bottom 0.254: R5.2 139.1,100.14 139.1,21.36 82.78,21.36 81.47,22.67 75.41,22.67 74.85,22.1 73.47,22.1 v72.84,22.73
D-  (via drill 0.5)
  Top 0.254: IC1.3 73.46,25.07 73.46,24.71 70.66,21.91 v70.55,21.91
  Bottom 0.254: R4.2 140.59,102.78 140.59,20.76 82.65,20.76 81.29,22.13 75.64,22.13 75.14,21.63 70.82,21.63 v70.55,21.91
GND  (via drill 0.35, 0.5)
  Top 0.152: IC1.5 74.43,23.63 73.52,22.72 73.52,22.45 72.02,20.95 69.22,20.95 69.22,25.4 70.39,26.57 IC1.43 | J2.5 129.51,108.56 128.91,107.95 127,107.95 125.73,109.22 125.73,112.39 125.42,112.71 123.19,112.71
  Top 0.254: v92.58,30.23 U$7.14 | v79.41,31.31 78.67,32.05 IC1.23 | v83.43,25.14 83.43,25.01 82.77,24.35 v82.77,22.86 | 123.19,112.71 123.06,112.58 C6.2 | v109.22,110.49 108.58,110.49 S1.3 | v81.28,110.49 81.28,110.62 D25.K | v99.06,110.49 98.42,110.49 S3.3 | v49.61,26.07 49.61,26.24 49.29,26.56 49.29,26.88 U2.2 48.5,27.67 48.5,27.99 43.47,33.02 v41.28,33.02 | v52.07,22.86 51.2,22.86 50.66,23.41 49.53,23.41 48.89,22.77 U3.2 | SW1.4 SW1.2 | IC1.35 70.83,30.57 v70.04,31.37 | IC1.15 80.09,27.57 80.56,27.11 v80.76,27.11 | v57.4,17.53 54.17,20.76 v54.17,20.95 | Y1.2 81.91,28.32 v81.6,28.64
  Bottom 0.254: v109.22,110.49 v99.06,110.49 96.29,110.49 95.55,111.22 92.41,111.22 91.67,110.49 v81.28,110.49 36.69,110.49 30.42,104.22 D27.C 28.58,101.66 28.58,43.12 J1.EARTH 38.68,33.02 v41.28,33.02 | C8.2 63.84,29.11 | C14.2 66.52,29.21 67.3,29.99 68.28,29.99 69.47,31.17 70.04,31.17 v70.04,31.37 | R3.1 57.36,17.56 v57.4,17.53
  other vias: 64.14,26.67
  pour Top (isolate 0.305): 25.4,114.3 25.4,24.13 0,24.13 0,0 62.23,0 62.23,18.41 144.78,18.41 144.78,114.3
  pour Bottom (isolate 0.305): 25.4,114.3 25.4,24.13 0,24.13 0,0 62.23,0 62.23,18.41 144.78,18.41 144.78,114.3
N$1
  Top 0.254: R2.1 115.93,110.13 D26.K
N$2
  Bottom 0.254: R10.1 30.42,97.62 D27.A
N$3  (via drill 0.5)
  Top 0.254: U3.1 47.95,22.54 49.21,23.81 51.56,23.81 51.56,32.03 v52.45,32.92 | v51.82,37.91 50.17,39.56 50.17,110.49 78.11,110.49 80.51,108.08 97.74,108.08 99.78,106.05 111.53,106.05 113.92,108.43 R2.2
  Bottom 0.254: v51.82,37.91 52.45,37.27 v52.45,32.92
N$4
  Top 0.254: U3.5 46.99,23.84 46.99,20.95 52.8,20.95 52.8,25.09 R8.1
N$5
  Top 0.254: R6.1 84.96,111.25 D25.A
N$6  (via drill 0.35)
  Top 0.152: IC1.33 72.38,32.05 v71.79,32.64
  Bottom 0.152: v71.79,32.64 71.79,31.3 R7.1
N$7  (via drill 0.5)
  Top 0.254: K1.P$2 40,98.42 40.6,97.82 40.6,95.22 40,94.62 K7.P$2 40,79.37 40.6,78.77 40.6,76.17 40,75.57 K13.P$2 40,60.32 40.6,59.72 40.6,57.12 40,56.52 K19.P$2 | v38.73,34.29 35.74,31.3 35.74,26.22 31.11,21.59 26.67,17.14 K25.P$2
  Bottom 0.254: K19.P$2 40,41.27 40.6,40.67 40.6,38.07 40,37.47 R11.1 38.73,35.14 v38.73,34.29
N$8  (via drill 0.5)
  Top 0.254: K2.P$2 59.06,98.42 59.65,97.82 59.65,95.22 59.06,94.62 K8.P$2 59.06,79.37 59.65,78.77 59.65,76.17 59.06,75.57 K14.P$2 59.06,60.32 59.65,59.72 59.65,57.12 59.06,56.52 K20.P$2 | K26.P$2 36.83,20.32 36.83,31.11 40.64,34.92 44.45,34.92 45.72,33.66 48.26,33.66 49.53,34.92 57.05,34.92 v57.15,34.83
  Bottom 0.254: K20.P$2 60.11,44.45 R12.1 60.14,41.25 60.14,38.51 57.15,35.53 v57.15,34.83
N$9  (via drill 0.5)
  Top 0.254: K3.P$2 78.11,100.96 78.7,100.36 78.7,97.76 78.11,97.16 K9.P$2 78.11,81.91 78.7,81.31 78.7,78.71 78.11,78.11 K15.P$2 78.11,62.86 78.7,62.26 78.7,59.66 78.11,59.06 K21.P$2 79.38,46.99 88.8,37.56 v91.19,37.56 | K27.P$2 40.64,17.14 37.47,20.32 37.47,30.48 41.28,34.29 43.81,34.29 45.09,33.02 48.89,33.02 49.97,34.09 58.72,34.09 59.55,34.92 90.83,34.92 v91.19,34.57
  Bottom 0.254: K21.P$2 75.14,46.99 R13.1 | v91.19,34.57 v91.19,37.56
N$10
  Top 0.254: K4.P$2 97.16,103.5 97.75,102.9 97.75,100.3 97.16,99.7 K10.P$2 97.16,84.45 97.75,83.85 97.75,81.25 97.16,80.65 K16.P$2 97.16,65.4 97.75,64.8 97.75,62.2 97.16,61.6 K22.P$2
  Bottom 0.254: K22.P$2 97.16,46.35 97.75,45.75 97.75,43.15 97.37,42.77 R14.1
N$11  (via drill 0.35, 0.5)
  Top 0.254: v103.38,109.22 103.41,109.26 S1.1 | v121.22,109.6 119.72,109.6 R9.2
  Bottom 0.254: v103.38,109.22 108.78,109.22 112.02,105.98 119.63,105.98 121.22,107.57 v121.22,109.6
N$12  (via drill 0.5)
  Top 0.254: U2.3 50.64,28.07 v50.64,32.89 | S1.2 104.78,111.01 104.78,107.12 100.46,107.12 98.74,108.84 81.03,108.84 78.61,111.25 49.28,111.25 49.28,38.93 v50.55,37.66
  Bottom 0.254: v50.64,32.89 50.64,37.56 v50.55,37.66
N$13
  Top 0.254: K5.P$2 116.2,100.96 116.8,100.36 116.8,97.76 116.2,97.16 K11.P$2 116.2,81.91 116.8,81.31 116.8,78.71 116.2,78.11 K17.P$2 116.2,62.86 116.8,62.26 116.8,59.66 116.2,59.06 K23.P$2
  Bottom 0.254: K23.P$2 116.2,43.81 116.8,43.21 116.8,40.61 116.42,40.23 R15.1
N$14
  Top 0.254: K6.P$2 135.25,97.15 135.85,96.55 135.85,93.95 135.25,93.35 K12.P$2 135.25,78.1 135.85,77.5 135.85,74.9 135.25,74.3 K18.P$2 135.25,59.05 135.85,58.45 135.85,55.85 135.25,55.25 K24.P$2
  Bottom 0.254: K24.P$2 135.25,40 135.85,39.4 135.85,36.8 135.47,36.42 R16.1
N$15  (via drill 0.35)
  Top 0.152: J2.3 130.81,107.95 129.54,106.68 v129.54,103.5
  Bottom 0.152: v129.54,103.5 137.44,103.5 R5.1
N$16  (via drill 0.5)
  Top 0.152: J2.2 131.46,107.33 130.81,106.68 130.81,105.6 v131.44,104.97
  Bottom 0.254: v131.44,104.97 131.47,104.99 R4.1
N$17  (via drill 0.35)
  Top 0.152: U$7.6 83.82,23.88 83.82,20.95 93.4,20.95 93.4,31.01 93.34,31.01 93.34,35.56
  Top 0.254: 93.34,35.56 49.53,35.56 42.55,42.55 36.83,42.55 30.73,48.64 30.73,93.03 v30.67,93.09
  Bottom 0.254: v30.67,93.09 R10.2
N$23
  Bottom 0.254: K1.P$1 33.66,87.5 D1.A
N$24
  Bottom 0.254: K2.P$1 52.7,87.63 D2.A
N$25
  Bottom 0.254: K3.P$1 71.75,90.17 D3.A
N$26
  Bottom 0.254: K4.P$1 90.81,92.71 D4.A
N$27
  Bottom 0.254: K5.P$1 109.86,90.17 D5.A
N$28
  Bottom 0.254: K6.P$1 128.91,86.36 D6.A
N$29
  Bottom 0.254: K12.P$1 128.91,67.31 D12.A
N$30
  Bottom 0.254: K11.P$1 109.86,71.12 D11.A
N$31
  Bottom 0.254: K10.P$1 90.81,73.66 D10.A
N$32
  Bottom 0.254: K9.P$1 71.75,71.12 D9.A
N$33
  Bottom 0.254: K8.P$1 52.7,68.58 D8.A
N$34
  Bottom 0.254: K7.P$1 33.66,68.58 D7.A
N$35
  Bottom 0.254: K13.P$1 33.66,49.53 D13.A
N$36
  Bottom 0.254: K14.P$1 52.7,49.53 D14.A
N$37
  Bottom 0.254: K15.P$1 71.75,52.07 D15.A
N$38
  Bottom 0.254: K16.P$1 90.81,54.61 D16.A
N$39
  Bottom 0.254: K17.P$1 109.86,52.07 D17.A
N$40
  Bottom 0.254: K18.P$1 128.91,48.26 D18.A
N$41
  Bottom 0.254: D24.A K24.P$1
N$42
  Bottom 0.254: D23.A K23.P$1
N$43
  Bottom 0.254: D22.A K22.P$1
N$44
  Top 0.254: D21.A 71.31,44.45 K21.P$1
N$45
  Bottom 0.254: D20.A 52.7,41.27 K20.P$1
N$46
  Bottom 0.254: K19.P$1 33.66,46.36 41.28,53.97 D19.A
N$53
  Top 0.254: D33.A 47.62,9.52 K27.P$1
N$54
  Top 0.254: D32.A 27.31,8.89 K26.P$1
N$55
  Bottom 0.254: K25.P$1 15.24,21.59 D31.A
ROW0  (via drill 0.5)
  Top 0.254: IC1.37 70.02,29.57 v65.41,34.19 | v63.66,39.94 63.66,84.29 D2.C
  Bottom 0.254: D1.C 51.44,87 52.7,85.73 53.97,85.73 55.25,87 D2.C 77.47,87 D3.C 96.52,89.53 D4.C 102.87,88.27 116.84,88.27 D5.C 123.19,84.45 135.89,84.45 D6.C | v63.66,39.94 63.66,35.94 v65.41,34.19
ROW1  (via drill 0.5)
  Top 0.254: IC1.38 69.25,29.07 v64.14,34.19 | v62.42,39.94 62.42,66.48 D8.C
  Bottom 0.254: D7.C 51.44,67.94 52.7,66.67 53.79,66.67 55.06,67.94 D8.C 77.47,67.94 D9.C 81.93,70.48 83.95,68.47 94.5,68.47 D10.C 102.87,69.22 116.84,69.22 D11.C 123.19,65.41 135.89,65.41 D12.C | v62.42,39.94 62.42,35.91 v64.14,34.19
ROW2  (via drill 0.5)
  Top 0.254: v62.86,34.19 68.48,28.57 IC1.39 | D14.C 61.21,48.64 v61.21,39.94
  Bottom 0.254: D13.C 51.54,48.89 52.76,47.68 53.84,47.68 55.06,48.89 60.78,48.89 D14.C 65.14,48.89 65.47,48.56 77.14,48.56 D15.C 96.52,51.44 D16.C 102.87,50.16 116.84,50.16 D17.C 123.19,46.36 135.89,46.36 D18.C | v61.21,39.94 61.21,35.84 v62.86,34.19
ROW3  (via drill 0.5)
  Top 0.254: D20.C 46.99,40 50.8,36.2 59.94,36.2 | 59.94,36.2 65.98,36.2 D21.C 70.88,42.16 74.27,38.77 76.86,38.77 80.25,42.16 82.3,42.16 D22.C 87.63,36.83 D23.C 107.95,33.02 D24.C | v60.33,33.56 65.81,28.07 IC1.40 | v59.94,37.12 59.94,36.2
  Bottom 0.254: D19.C D20.C | v59.94,37.12 59.94,33.94 v60.33,33.56
ROW4  (via drill 0.5)
  Top 0.254: D31.C D32.C 21.59,4.9 20.37,3.68 20.37,2.67 21.09,1.96 25.44,1.96 34.28,10.79 D33.C 46.99,16.51 52.62,16.51 53.39,15.74 54.56,15.74 54.69,15.87 60.33,15.87 60.33,20.95 61.63,22.26 v64.2,22.26 | v68.11,22.26 68.17,22.31 68.17,27.57 IC1.41
  Bottom 0.254: v68.11,22.26 v64.2,22.26
RST
  Top 0.254: IC1.13 78.5,26.48 78.92,26.48 80,25.4 81.91,25.4 81.91,20.13 67.43,20.13 SW1.3 SW1.1
RX  (via drill 0.5)
  Top 0.254: IC1.20 80.24,30.07 81.28,31.11 87.76,31.11 87.76,26.35 90.66,26.35 U$7.11 92.23,26.42 v92.61,26.03
  Bottom 0.254: J1.TIP 38.22,31.11 45.72,31.11 48.26,28.57 59.5,28.57 64.45,23.62 90.2,23.62 v92.61,26.03
SIG_MODE  (via drill 0.5)
  Top 0.254: IC1.19 79.17,29.57 v79.41,29.34 | U$7.13 v89.09,28.96 89.09,31.37 v92.33,34.61 | v92.39,37.66 92.39,42.24 87.56,47.07 v87.56,103.5 | v94.68,109.67 94.75,109.74 S3.2
  Bottom 0.254: v79.41,29.34 88.71,29.34 v89.09,28.96 | v92.33,34.61 92.39,34.67 v92.39,37.66 | v87.56,103.5 93.12,109.06 93.46,109.06 94.06,109.67 v94.68,109.67
TX  (via drill 0.5)
  Top 0.254: IC1.21 79.72,30.57 80.9,31.75 88.33,31.75 88.33,27.69 U$7.12 92.23,27.69 v92.61,27.3
  Bottom 0.254: J1.RING2 28.58,28.52 28.58,30.48 31.59,33.49 34.72,33.49 36.47,31.75 45.95,31.75 48.59,29.11 59.79,29.11 64.81,24.09 89.4,24.09 v92.61,27.3
VBAT  (via drill 0.5)
  Top 0.254: v50.8,22.22 49.88,22.22 U3.3
  Bottom 0.254: D$4.A C3.1 | C3.1 42.47,22.46 X1.2 | C3.1 46.36,21.27 49.84,21.27 v50.8,22.22 50.8,20.11 R1.2
VBUS  (via drill 0.35, 0.5)
  Top 0.152: v132.08,106.49 132.08,109.46 J2.1
  Top 0.254: v45.09,27.3 47.92,27.3 U2.1 47.95,26.7 U3.4 49.84,25.18 v50.7,26.03 | v76.26,21.4 75.43,22.23 IC1.7 | v114.49,107.06 118.83,107.06 R9.1 120.12,107.51 C6.1 126.08,107.51 v126.95,106.63
  Bottom 0.152: v126.95,106.63 127.09,106.49 v132.08,106.49
  Bottom 0.254: J1.RING1 33.09,28.5 34.92,26.67 40.7,26.67 D$4.C 45.09,28.52 v45.09,27.3 | v50.7,26.03 55.66,21.08 75.95,21.08 v76.26,21.4 76.51,21.64 81.2,21.64 82.61,20.23 142.18,20.23 142.18,106.49 v132.08,106.49 | v114.49,107.06 112.01,109.54 D26.A
XTAL1
  Top 0.254: U$7.2 85.66,28.96 85.09,29.52 Y1.1 81.11,29.52 80.19,28.61 78.44,28.61 IC1.17
XTAL2
  Top 0.254: IC1.16 78.44,28.11 81.2,28.11 82.19,27.12 Y1.3 84.36,27.12 84.92,27.69 U$7.3

### Text on the board
bPlace: Designed by Eddie Tian / 2020/06